# Altium project DualColorLEDLighting-PCB.PrjPcb
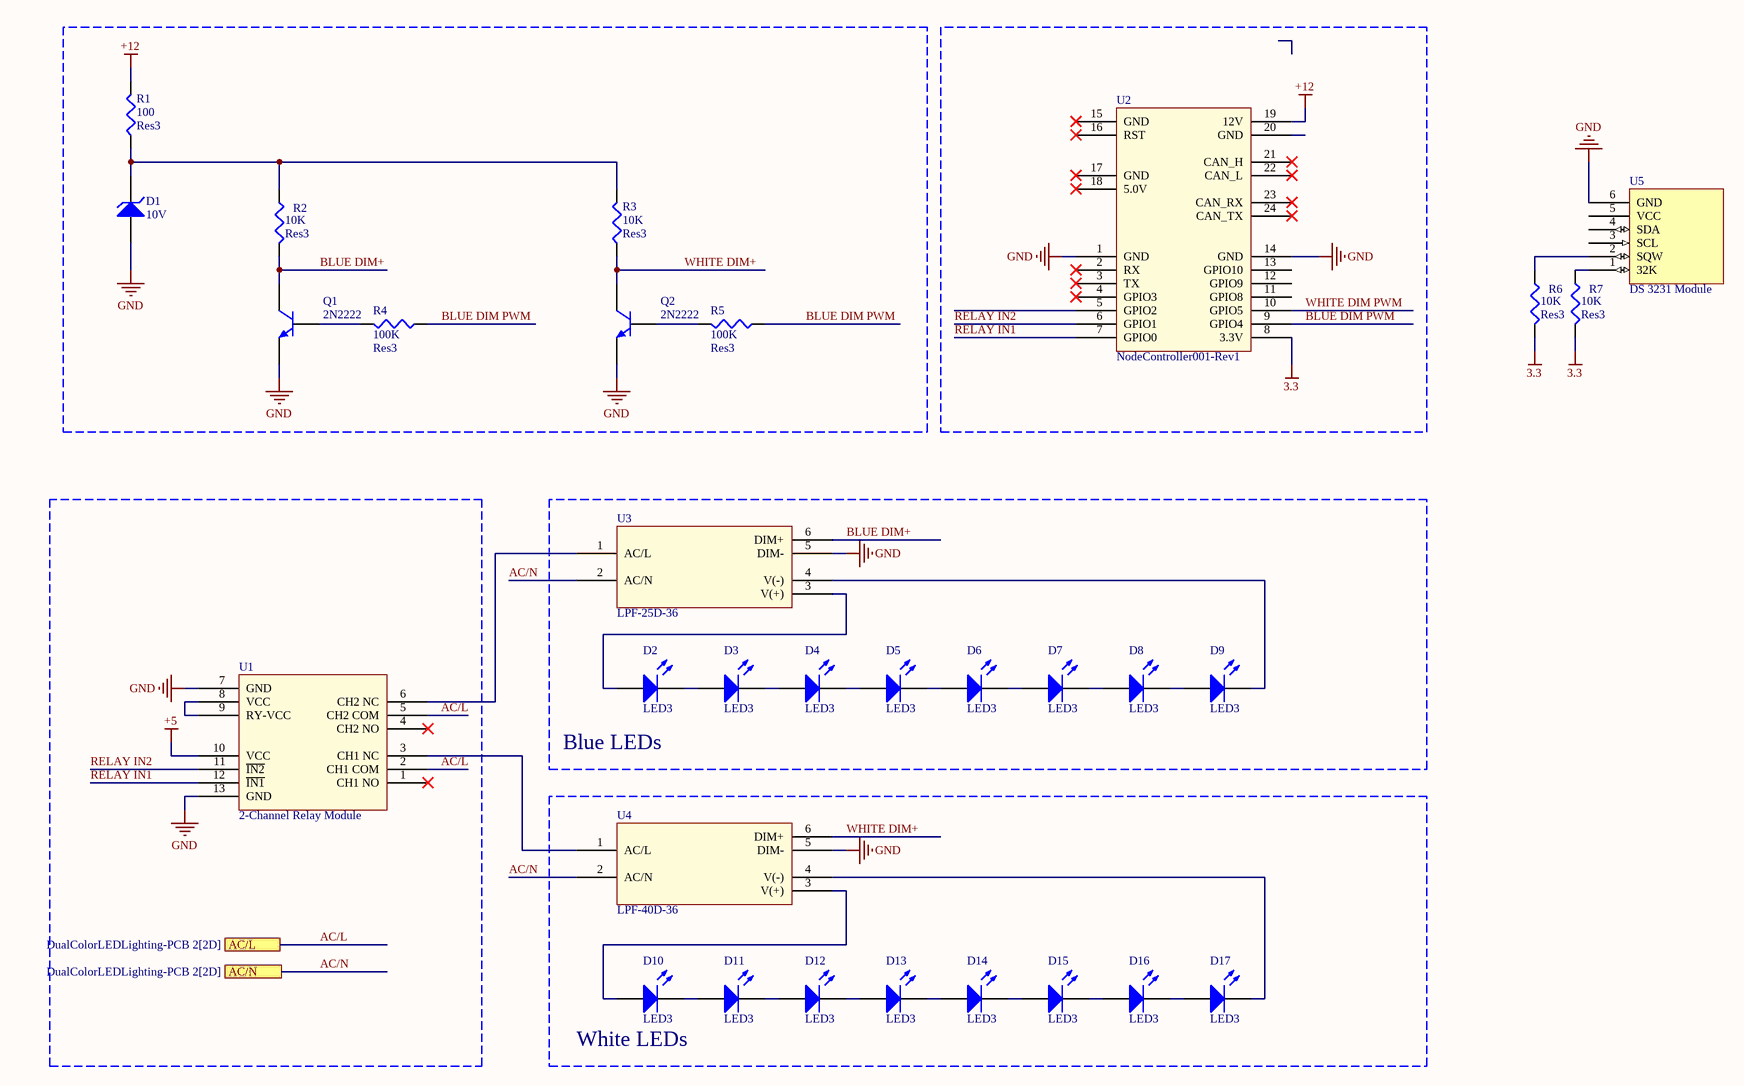
[diagram p0: DualColorLEDLighting-PCB.SchDoc]
2 sheets, 60 parts. Net scope: flat (ports and power ports of the same name join across sheets).
Sheets:
  DualColorLEDLighting-PCB.SchDoc
  DualColorLEDLighting-PCB 2.SchDoc

## Sheet DualColorLEDLighting-PCB.SchDoc
size A3; SheetNumber: 1; SheetTotal: 1

### Parts
(Parts that share a designator on the sheet are numbered #1, #2 ... from top to bottom, then left to right.)
D1#1  10V  [DIODE-0.7]
D2#1  LED3  [3.5X2.8X1.9]
D3#1  LED3  [3.5X2.8X1.9]
D4#1  LED3  [3.5X2.8X1.9]
D5#1  LED3  [3.5X2.8X1.9]
D6#1  LED3  [3.5X2.8X1.9]
D7#1  LED3  [3.5X2.8X1.9]
D8#1  LED3  [3.5X2.8X1.9]
D9#1  LED3  [3.5X2.8X1.9]
D10#1  LED3  [3.5X2.8X1.9]
D11#1  LED3  [3.5X2.8X1.9]
D12#1  LED3  [3.5X2.8X1.9]
D13#1  LED3  [3.5X2.8X1.9]
D14#1  LED3  [3.5X2.8X1.9]
D15#1  LED3  [3.5X2.8X1.9]
D16#1  LED3  [3.5X2.8X1.9]
D17#1  LED3  [3.5X2.8X1.9]
Q1#1  2N2222  [TO-226-AA]
Q2#1  2N2222  [TO-226-AA]
R1#1  Res3  value 100  [J1-0603]
R2#1  Res3  value 10K  [J1-0603]
R3#1  Res3  value 10K  [J1-0603]
R4#1  Res3  value 100K  [J1-0603]
R5#1  Res3  value 100K  [J1-0603]
R6  Res3  value 10K  [J1-0603]
R7  Res3  value 10K  [J1-0603]
U1#1  2-Channel Relay Module
U2  NodeController001-Rev1
U3#1  LPF-25D-36
U4#1  LPF-40D-36
U5  DS 3231 Module  [RAD0.1B]

### Blocks framed on the sheet
Blue LEDs: D2#1 D3#1 D4#1 D5#1 D6#1 D7#1 D8#1 D9#1 U3#1
White LEDs: D10#1 D11#1 D12#1 D13#1 D14#1 D15#1 D16#1 D17#1 U4#1

### Ports
AC/L (see DualColorLEDLighting-PCB 2[2D]), AC/N (see DualColorLEDLighting-PCB 2[2D])

### Nets
3.3: R6.2 R7.2 U2.8(3.3V)
+5: U1#1.10(VCC)
+12: R1#1.2 U2.19(12V)
GND: D1#1.1(A) Q1#1.3(E) Q2#1.3(E) U1#1.7(GND) U1#1.13(GND) U2.1(GND) U2.14(GND) U3#1.5(DIM-) U4#1.5(DIM-) U5.6(GND)
AC/L: U1#1.2(CH1_COM) U1#1.5(CH2_COM) ; port AC/L
AC/N: U3#1.2(AC/N) U4#1.2(AC/N) ; port AC/N
BLUE DIM PWM: R4#1.1 R5#1.1 U2.9(GPIO4)
BLUE DIM+: Q1#1.1(C) R2#1.2 U3#1.6(DIM+)
RELAY IN1: U1#1.12(~{IN1}) U2.7(GPIO0)
RELAY IN2: U1#1.11(~{IN2}) U2.6(GPIO1)
WHITE DIM PWM: U2.10(GPIO5)
WHITE DIM+: Q2#1.1(C) R3#1.1 U4#1.6(DIM+)
NetD1#1_2: D1#1.2(K) R1#1.1 R2#1.1 R3#1.2
NetD2#1_1: D2#1.1(A) U3#1.3(V(+))
NetD2#1_2: D2#1.2(K) D3#1.1(A)
NetD3#1_2: D3#1.2(K) D4#1.1(A)
NetD4#1_2: D4#1.2(K) D5#1.1(A)
NetD5#1_2: D5#1.2(K) D6#1.1(A)
NetD6#1_2: D6#1.2(K) D7#1.1(A)
NetD7#1_2: D7#1.2(K) D8#1.1(A)
NetD8#1_2: D8#1.2(K) D9#1.1(A)
NetD9#1_2: D9#1.2(K) U3#1.4(V(-))
NetD10#1_1: D10#1.1(A) U4#1.3(V(+))
NetD10#1_2: D10#1.2(K) D11#1.1(A)
NetD11#1_2: D11#1.2(K) D12#1.1(A)
NetD12#1_2: D12#1.2(K) D13#1.1(A)
NetD13#1_2: D13#1.2(K) D14#1.1(A)
NetD14#1_2: D14#1.2(K) D15#1.1(A)
NetD15#1_2: D15#1.2(K) D16#1.1(A)
NetD16#1_2: D16#1.2(K) D17#1.1(A)
NetD17#1_2: D17#1.2(K) U4#1.4(V(-))
NetQ1#1_2: Q1#1.2(B) R4#1.2
NetQ2#1_2: Q2#1.2(B) R5#1.2
NetR6_1: R6.1 U5.2(SQW)
NetR7_1: R7.1 U5.1(32K)
NetU1#1_3: U1#1.3(CH1_NC) U4#1.1(AC/L)
NetU1#1_6: U1#1.6(CH2_NC) U3#1.1(AC/L)
NetU1#1_8: U1#1.8(VCC) U1#1.9(RY-VCC)

Not connected (* = marked no-connect by the designer): U1#1 1(CH1_NO)* 4(CH2_NO)*; U2 2(RX)* 3(TX)* 4(GPIO3)* 5(GPIO2) 11(GPIO8) 12(GPIO9) 13(GPIO10) 15(GND)* 16(RST)* 17(GND)* 18(5.0V)* 20(GND) 21(CAN_H)* 22(CAN_L)* 23(CAN_RX)* 24(CAN_TX)*; U5 3(SCL) 4(SDA) 5(VCC)

### Library data of the parts
D1#1 = D Zener: Zener Diode; Published: 8-Jun-2000; LatestRevisionDate: 17-Jul-2002; LatestRevisionNote: Re-released for DXP Platform.; PackageReference: DIODE-0.7; Publisher: Altium Limited; PackageDescription: Diode, Thru-Hole; 2 Leads; 0.7 in Pin Spacing
D2#1 D3#1 D4#1 D5#1 D6#1 D7#1 D8#1 D9#1 D10#1 D11#1 D12#1 D13#1 D14#1 D15#1 D16#1 D17#1 = LED3: Typical BLUE SiC LED; Published: 8-Jun-2000; LatestRevisionDate: 17-Dec-2003; LatestRevisionNote: PCB Footprint replaced.; DatasheetVersion: 16-Apr-2002; PackageVersion: 16-Apr-2002; PackageReference: 3.5X2.8X1.9; Publisher: Altium Limited; PackageDescription: SM LED; 2 C-Bend Leads; Body 3.5 x 2.8 x 1.9 mm, inc leads (LxWxH typ)
Q1#1 Q2#1 = NPN: NPN Bipolar Transistor; Published: 8-Jun-2000; LatestRevisionDate: 17-Jul-2002; LatestRevisionNote: Re-released for DXP Platform.; PackageReference: TO-226-AA; Publisher: Altium Limited; PackageDescription: TO, Flat Index; 3 In-Line, Axial Leads; Body Dia. 4.8mm; Leads 0.55 x 0.51 mm (max); Code_JEDEC: TO-226-AA
R1#1 R2#1 R3#1 R4#1 R5#1 R6 R7 = Res3: Resistor; Published: 8-Jun-2000; LatestRevisionDate: 29-May-2009; LatestRevisionNote: IPC-7351 Footprint Added.; PackageReference: J1-0603; Publisher: Altium Limited; PackageDescription: Chip Resistor
U1#1 = 2-Channel Relay Module: 2-Channel Relay Module for Arduino & Raspberry Pi - 5V
U3#1 = LPF-25D-36: LED DRVR CC AC/DC 19.8-36V 700MA
U4#1 = LPF-40D-36: LED DRVR CC AC/DC 21.6-36V 1.12A
U5 = DS 3231 Module: DS3231 Real Time Clock Module

## Sheet DualColorLEDLighting-PCB 2.SchDoc
size A3; SheetNumber: 2; SheetTotal: 2
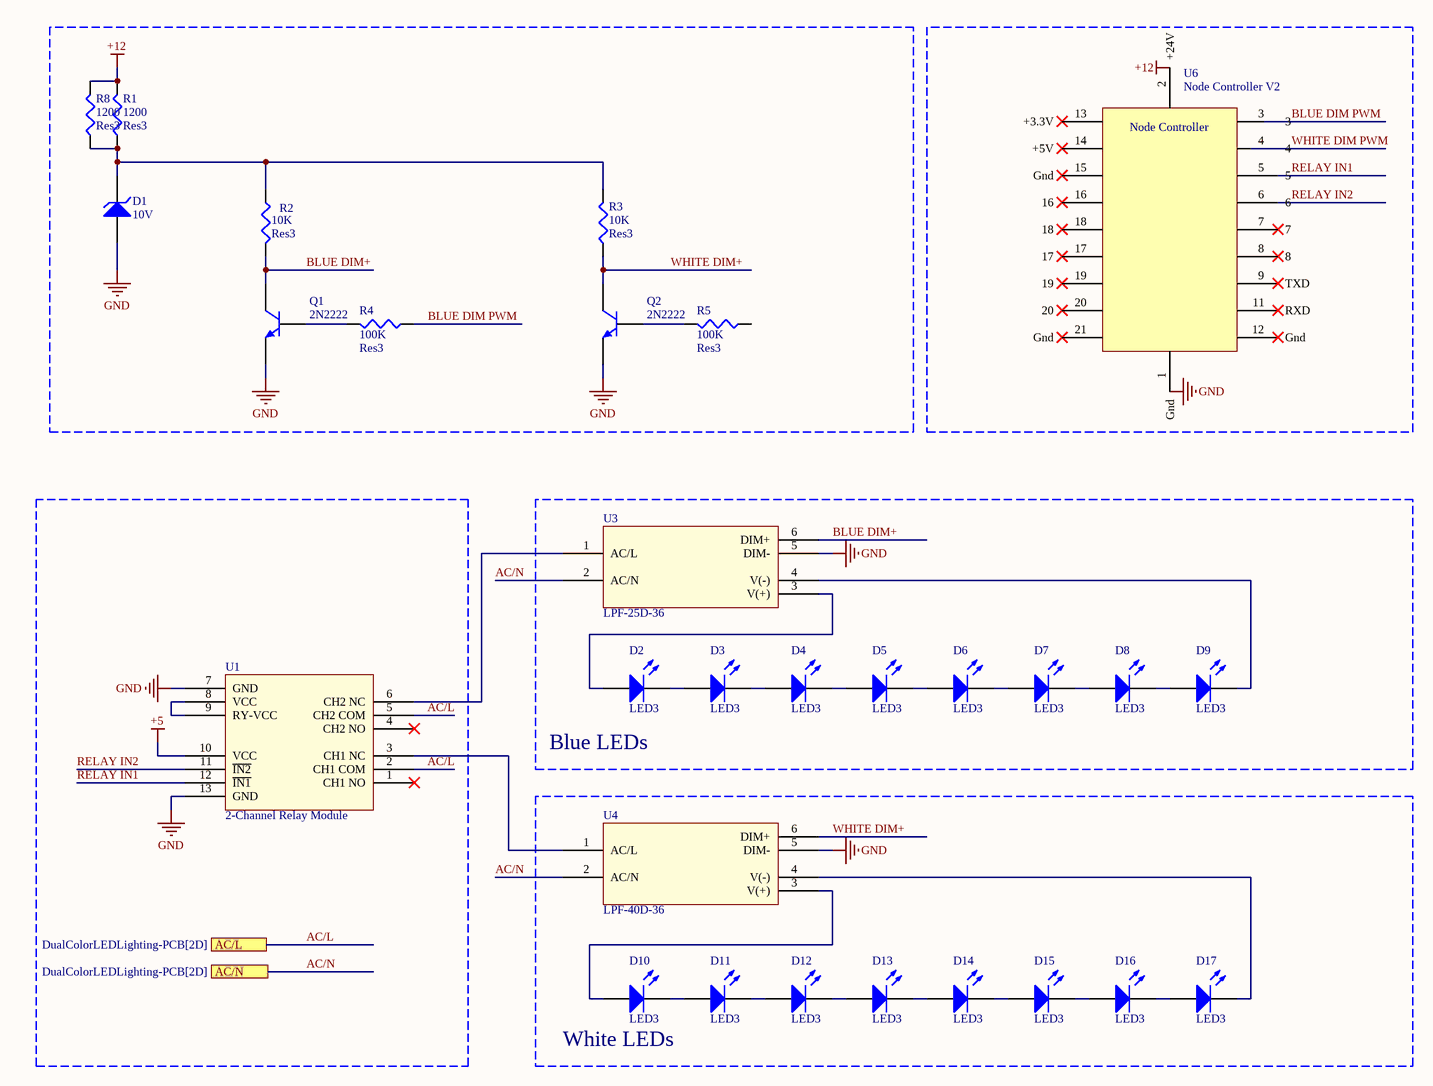
[diagram p1: DualColorLEDLighting-PCB 2.SchDoc]

### Parts
(Parts that share a designator on the sheet are numbered #1, #2 ... from top to bottom, then left to right.)
D1#2  10V  [DIODE-0.7]
D2#2  LED3  [3.5X2.8X1.9]
D3#2  LED3  [3.5X2.8X1.9]
D4#2  LED3  [3.5X2.8X1.9]
D5#2  LED3  [3.5X2.8X1.9]
D6#2  LED3  [3.5X2.8X1.9]
D7#2  LED3  [3.5X2.8X1.9]
D8#2  LED3  [3.5X2.8X1.9]
D9#2  LED3  [3.5X2.8X1.9]
D10#2  LED3  [3.5X2.8X1.9]
D11#2  LED3  [3.5X2.8X1.9]
D12#2  LED3  [3.5X2.8X1.9]
D13#2  LED3  [3.5X2.8X1.9]
D14#2  LED3  [3.5X2.8X1.9]
D15#2  LED3  [3.5X2.8X1.9]
D16#2  LED3  [3.5X2.8X1.9]
D17#2  LED3  [3.5X2.8X1.9]
Q1#2  2N2222  [TO-226-AA]
Q2#2  2N2222  [TO-226-AA]
R1#2  Res3  value 1200  [J1-0603]
R2#2  Res3  value 10K  [J1-0603]
R3#2  Res3  value 10K  [J1-0603]
R4#2  Res3  value 100K  [J1-0603]
R5#2  Res3  value 100K  [J1-0603]
R8  Res3  value 1200  [J1-0603]
U1#2  2-Channel Relay Module
U3#2  LPF-25D-36
U4#2  LPF-40D-36
U6  Node Controller V2

### Blocks framed on the sheet
Blue LEDs: D2#2 D3#2 D4#2 D5#2 D6#2 D7#2 D8#2 D9#2 U3#2
White LEDs: D10#2 D11#2 D12#2 D13#2 D14#2 D15#2 D16#2 D17#2 U4#2

### Ports
AC/L (see DualColorLEDLighting-PCB[2D]), AC/N (see DualColorLEDLighting-PCB[2D])

### Nets
+5: U1#2.10(VCC)
+12: R1#2.2 R8.2
GND: D1#2.1(A) Q1#2.3(E) Q2#2.3(E) U1#2.7(GND) U1#2.13(GND) U3#2.5(DIM-) U4#2.5(DIM-)
AC/L: U1#2.2(CH1_COM) U1#2.5(CH2_COM) ; port AC/L
AC/N: U3#2.2(AC/N) U4#2.2(AC/N) ; port AC/N
BLUE DIM PWM: R4#2.1
BLUE DIM+: Q1#2.1(C) R2#2.2 U3#2.6(DIM+)
RELAY IN1: U1#2.12(~{IN1})
RELAY IN2: U1#2.11(~{IN2})
WHITE DIM+: Q2#2.1(C) R3#2.1 U4#2.6(DIM+)
NetD1#2_2: D1#2.2(K) R1#2.1 R2#2.1 R3#2.2 R8.1
NetD2#2_1: D2#2.1(A) U3#2.3(V(+))
NetD2#2_2: D2#2.2(K) D3#2.1(A)
NetD3#2_2: D3#2.2(K) D4#2.1(A)
NetD4#2_2: D4#2.2(K) D5#2.1(A)
NetD5#2_2: D5#2.2(K) D6#2.1(A)
NetD6#2_2: D6#2.2(K) D7#2.1(A)
NetD7#2_2: D7#2.2(K) D8#2.1(A)
NetD8#2_2: D8#2.2(K) D9#2.1(A)
NetD9#2_2: D9#2.2(K) U3#2.4(V(-))
NetD10#2_1: D10#2.1(A) U4#2.3(V(+))
NetD10#2_2: D10#2.2(K) D11#2.1(A)
NetD11#2_2: D11#2.2(K) D12#2.1(A)
NetD12#2_2: D12#2.2(K) D13#2.1(A)
NetD13#2_2: D13#2.2(K) D14#2.1(A)
NetD14#2_2: D14#2.2(K) D15#2.1(A)
NetD15#2_2: D15#2.2(K) D16#2.1(A)
NetD16#2_2: D16#2.2(K) D17#2.1(A)
NetD17#2_2: D17#2.2(K) U4#2.4(V(-))
NetQ1#2_2: Q1#2.2(B) R4#2.2
NetQ2#2_2: Q2#2.2(B) R5#2.2
NetU1#2_3: U1#2.3(CH1_NC) U4#2.1(AC/L)
NetU1#2_6: U1#2.6(CH2_NC) U3#2.1(AC/L)
NetU1#2_8: U1#2.8(VCC) U1#2.9(RY-VCC)

Not connected (* = marked no-connect by the designer): R5#2 1; U1#2 1(CH1_NO)* 4(CH2_NO)*; U6 1(Gnd) 2(+24V) 3 4 5 6 7 8 9(TXD) 11(RXD) 12(Gnd) 13(+3.3V) 14(+5V) 15(Gnd) 16 17 18 19 20 21(Gnd)

### Notes on the sheet
- Labels drawn without touching a wire or pin: +12, GND
- (in symbol Node Controller V2) Node Controller

### Library data of the parts
D1#2 = D Zener: Zener Diode; Published: 8-Jun-2000; LatestRevisionDate: 17-Jul-2002; LatestRevisionNote: Re-released for DXP Platform.; PackageReference: DIODE-0.7; Publisher: Altium Limited; PackageDescription: Diode, Thru-Hole; 2 Leads; 0.7 in Pin Spacing
D2#2 D3#2 D4#2 D5#2 D6#2 D7#2 D8#2 D9#2 D10#2 D11#2 D12#2 D13#2 D14#2 D15#2 D16#2 D17#2 = LED3: Typical BLUE SiC LED; Published: 8-Jun-2000; LatestRevisionDate: 17-Dec-2003; LatestRevisionNote: PCB Footprint replaced.; DatasheetVersion: 16-Apr-2002; PackageVersion: 16-Apr-2002; PackageReference: 3.5X2.8X1.9; Publisher: Altium Limited; PackageDescription: SM LED; 2 C-Bend Leads; Body 3.5 x 2.8 x 1.9 mm, inc leads (LxWxH typ)
Q1#2 Q2#2 = NPN: NPN Bipolar Transistor; Published: 8-Jun-2000; LatestRevisionDate: 17-Jul-2002; LatestRevisionNote: Re-released for DXP Platform.; PackageReference: TO-226-AA; Publisher: Altium Limited; PackageDescription: TO, Flat Index; 3 In-Line, Axial Leads; Body Dia. 4.8mm; Leads 0.55 x 0.51 mm (max); Code_JEDEC: TO-226-AA
R1#2 R2#2 R3#2 R4#2 R5#2 R8 = Res3: Resistor; Published: 8-Jun-2000; LatestRevisionDate: 29-May-2009; LatestRevisionNote: IPC-7351 Footprint Added.; PackageReference: J1-0603; Publisher: Altium Limited; PackageDescription: Chip Resistor
U1#2 = 2-Channel Relay Module: as U1#1 on sheet DualColorLEDLighting-PCB
U3#2 = LPF-25D-36: LED DRVR CC AC/DC 19.8-36V 700MA
U4#2 = LPF-40D-36: LED DRVR CC AC/DC 21.6-36V 1.12A

## Nets that join several sheets
+5: DualColorLEDLighting-PCB (U1#1.10), DualColorLEDLighting-PCB 2 (U1#2.10)
+12: DualColorLEDLighting-PCB (R1#1.2 U2.19), DualColorLEDLighting-PCB 2 (R1#2.2 R8.2)
GND: DualColorLEDLighting-PCB (10 pins), DualColorLEDLighting-PCB 2 (7 pins)
AC/L: DualColorLEDLighting-PCB (U1#1.2 U1#1.5), DualColorLEDLighting-PCB 2 (U1#2.2 U1#2.5)
AC/N: DualColorLEDLighting-PCB (U3#1.2 U4#1.2), DualColorLEDLighting-PCB 2 (U3#2.2 U4#2.2)